# EAGLE design eurofima (EAGLE 9.5.2)
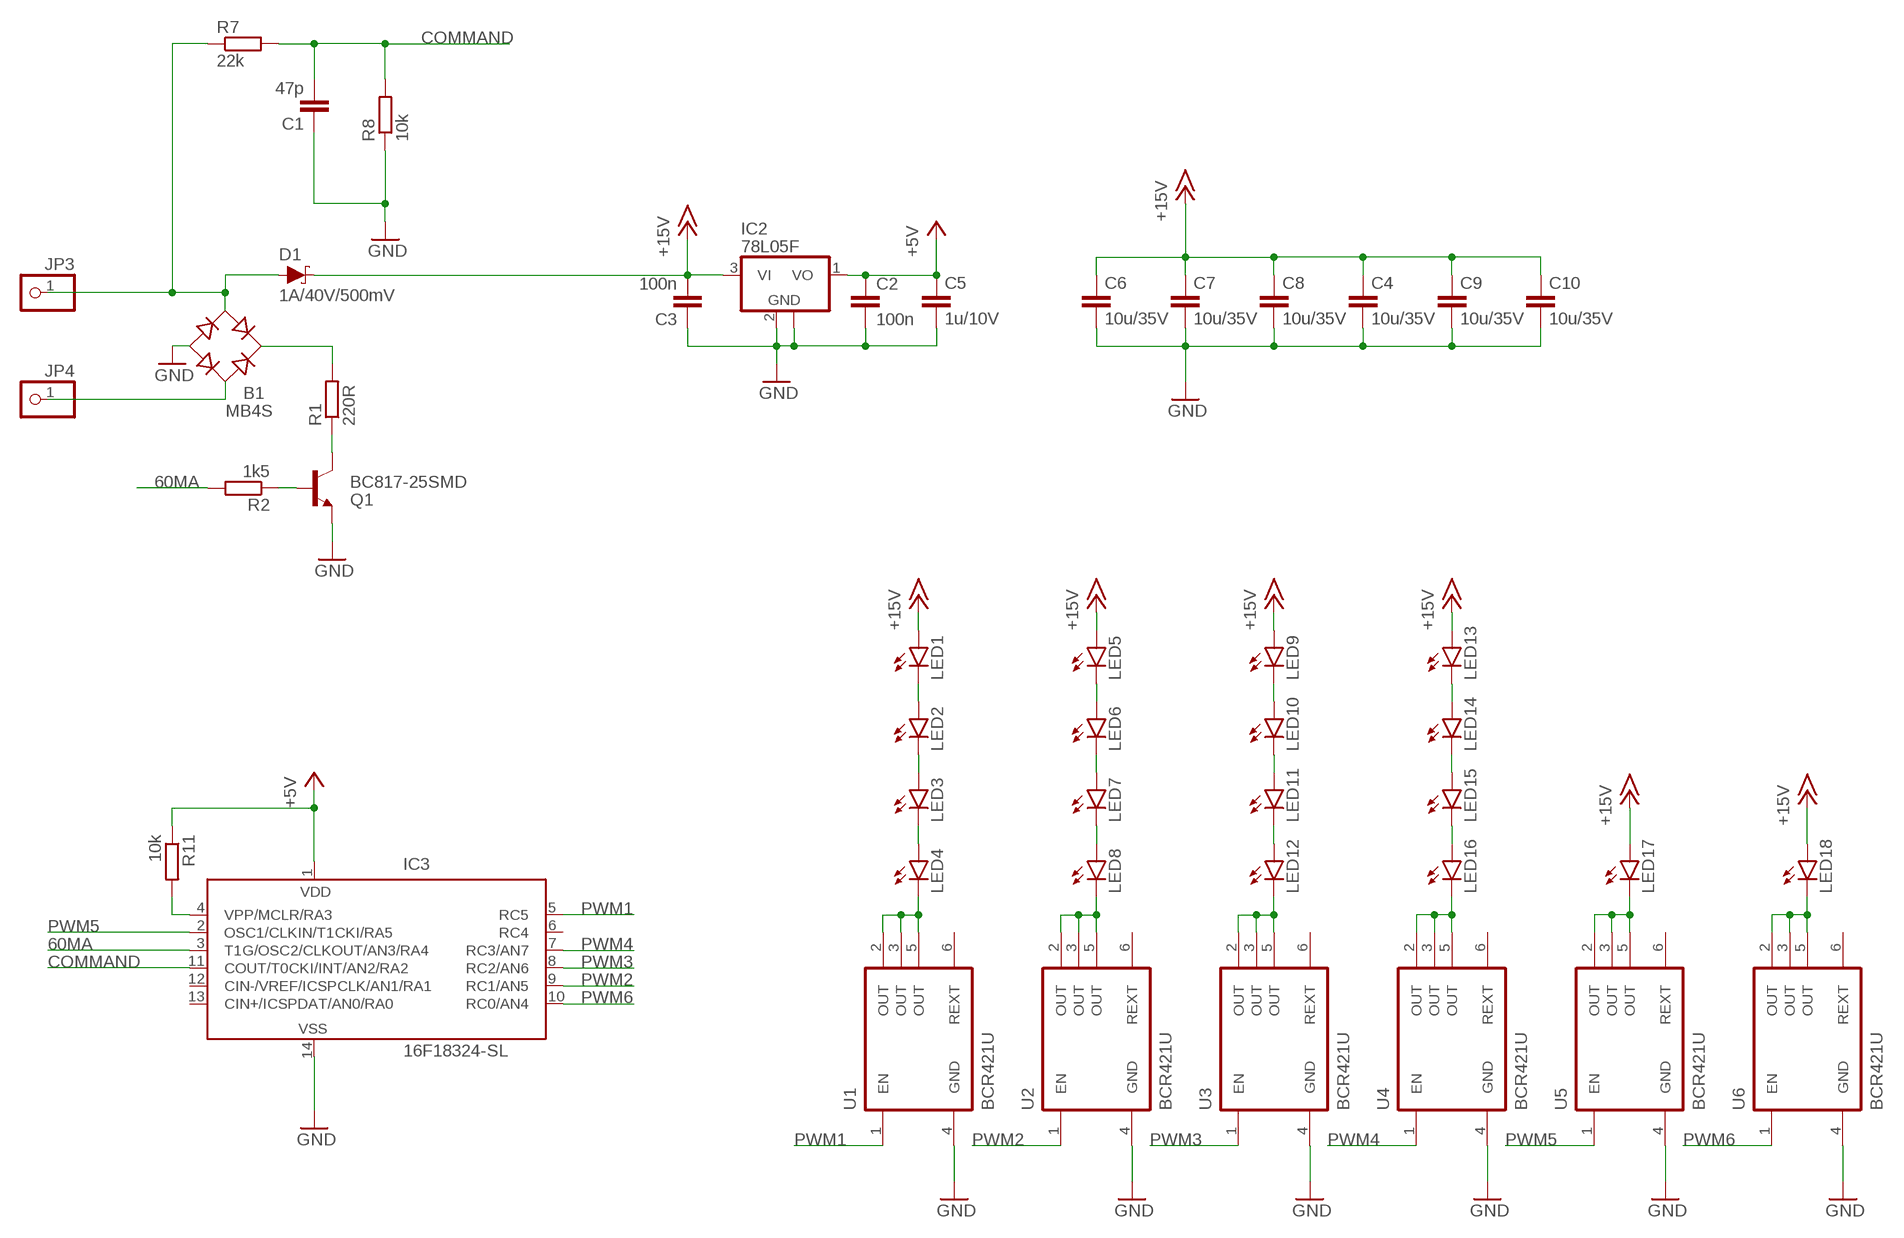
[diagram p0: schematic, sheet 1]

## Parts
B1  MB4S  [SOIC-4]
C1  47p  C-EUC0805  [C0805]
C2  100n  C-EUC3216  [C3216]
C3  100n  C-EUC3216  [C3216]
C4  10u/35V  C-EUC3216  [C3216]
C5  1u/10V  C-EUC3216  [C3216]
C6  10u/35V  C-EUC3216  [C3216]
C7  10u/35V  C-EUC3216  [C3216]
C8  10u/35V  C-EUC3216  [C3216]
C9  10u/35V  C-EUC3216  [C3216]
C10  10u/35V  C-EUC3216  [C3216]
D1  1A/40V/500mV  DIODE-SCHOTTKY-SS14  [SMA-DIODE]
IC2  78L05F  [SOT89]
IC3  16F18324-SL  PIC16F676SL  [SO-14]
JP3  PINHD-1X1  [1X01]
JP4  PINHD-1X1  [1X01]
LED1  LEDKA-3528ASYC  [KA-3528ASYC]
LED2  LEDKA-3528ASYC  [KA-3528ASYC]
LED3  LEDKA-3528ASYC  [KA-3528ASYC]
LED4  LEDKA-3528ASYC  [KA-3528ASYC]
LED5  LEDKA-3528ASYC  [KA-3528ASYC]
LED6  LEDKA-3528ASYC  [KA-3528ASYC]
LED7  LEDKA-3528ASYC  [KA-3528ASYC]
LED8  LEDKA-3528ASYC  [KA-3528ASYC]
LED9  LEDKA-3528ASYC  [KA-3528ASYC]
LED10  LEDKA-3528ASYC  [KA-3528ASYC]
LED11  LEDKA-3528ASYC  [KA-3528ASYC]
LED12  LEDKA-3528ASYC  [KA-3528ASYC]
LED13  LEDKA-3528ASYC  [KA-3528ASYC]
LED14  LEDKA-3528ASYC  [KA-3528ASYC]
LED15  LEDKA-3528ASYC  [KA-3528ASYC]
LED16  LEDKA-3528ASYC  [KA-3528ASYC]
LED17  LED3MM  [LED3MM]
LED18  LED3MM  [LED3MM]
Q1  BC817-25SMD  [SOT23-BEC]
R1  220R  R-EU_R1206  [R1206]
R2  1k5  R-EU_R1206  [R1206]
R7  22k  R-EU_R1206  [R1206]
R8  10k  R-EU_R1206  [R1206]
R11  10k  R-EU_R1206  [R1206]
U1  BCR421U  [SC74-6]
U2  BCR421U  [SC74-6]
U3  BCR421U  [SC74-6]
U4  BCR421U  [SC74-6]
U5  BCR421U  [SC74-6]
U6  BCR421U  [SC74-6]

## Nets
60MA: IC3.3(T1G/OSC2/CLKOUT/AN3/RA4) R2.2
+5V: C2.1 C5.1 IC2.1(VO) IC3.1(VDD) R11.1
+15V: C3.2 C4.1 C6.1 C7.1 C8.1 C9.1 C10.1 D1.C IC2.3(VI) LED1.A LED5.A LED9.A LED13.A LED17.A LED18.A
COMMAND: C1.2 IC3.11(COUT/T0CKI/INT/AN2/RA2) R7.2 R8.2
GND: B1.- C1.1 C2.2 C3.1 C4.2 C5.2 C6.2 C7.2 C8.2 C9.2 C10.2 IC2.2(GND) IC2.2@1(GND) IC3.14(VSS) Q1.E R8.1 U1.4(GND) U2.4(GND) U3.4(GND) U4.4(GND) U5.4(GND) U6.4(GND)
N$1: B1.~2(AC2) JP4.1
N$2: B1.~1(AC1) D1.A JP3.1 R7.1
N$3: Q1.C R1.1
N$4: Q1.B R2.1
N$5: B1.+ R1.2
N$10: LED3.C LED4.A
N$11: LED7.C LED8.A
N$12: LED11.C LED12.A
N$13: LED15.C LED16.A
N$14: LED16.C U4.2(OUT) U4.3(OUT) U4.5(OUT)
N$15: LED14.C LED15.A
N$16: LED10.C LED11.A
N$19: LED6.C LED7.A
N$20: LED2.C LED3.A
N$21: LED1.C LED2.A
N$22: LED5.C LED6.A
N$23: LED9.C LED10.A
N$24: LED13.C LED14.A
N$27: LED17.K(C) U5.2(OUT) U5.3(OUT) U5.5(OUT)
N$28: IC3.4(VPP/MCLR/RA3) R11.2
N$29: LED18.K(C) U6.2(OUT) U6.3(OUT) U6.5(OUT)
N$30: LED4.C U1.2(OUT) U1.3(OUT) U1.5(OUT)
N$31: LED12.C U3.2(OUT) U3.3(OUT) U3.5(OUT)
N$32: LED8.C U2.2(OUT) U2.3(OUT) U2.5(OUT)
PWM1: IC3.5(RC5) U1.1(EN)
PWM2: IC3.9(RC1/AN5) U2.1(EN)
PWM3: IC3.8(RC2/AN6) U3.1(EN)
PWM4: IC3.7(RC3/AN7) U4.1(EN)
PWM5: IC3.2(OSC1/CLKIN/T1CKI/RA5) U5.1(EN)
PWM6: IC3.10(RC0/AN4) U6.1(EN)
Unconnected: IC3.6(RC4) IC3.12(CIN-/VREF/ICSPCLK/AN1/RA1) IC3.13(CIN+/ICSPDAT/AN0/RA0) U1.6(REXT) U2.6(REXT) U3.6(REXT) U4.6(REXT) U5.6(REXT) U6.6(REXT)

## Library data of the parts
B1 = rectifier:MB*S: Bridge Rectifier Source: http://www.fairchildsemi.com/ds/MB/MB6S.pdf
C1-C10 = rcl:C-EU: CAPACITOR, European symbol; SPICEPREFIX: C
D1 = SparkFun-DiscreteSemi:DIODE-SCHOTTKY: Schottky diode A Schottky diode is a semiconductor diode which has a low forward voltage drop and a very fast switching action.; PROD_ID: DIO-08053
IC2 = linear:78L*: POSITOIV-VOLTAGE REGULATORS Output up to 100 mA Source: Datasheet <http://focus.ti.com/lit/ds/symlink/ua78l05.pdf>
IC3 = microchip:PIC16F676: 14-Pin, Flash-Based 8-Bit CMOS Microcontroller High Performance RISC CPU: * Only 35 instructions to learn - All single-cycle instructions except branches * Operating speed: - DC - 20 MHz oscillator/clock input - DC - 200 ns instruction cycle * Internal and external oscillator options - Precision Internal 4 MHz oscillator factory calibrated to ±1% - External Oscillator support for crystals and resonators - 5?s wake-up from SLEEP, 3.0V, typical * Power saving SLEEP mode * Wide operating voltage range - 2.0V to 5.5V * Industrial and Extended temperature range * Low power Power-on Reset (POR) * Power-up Timer (PWRT) and Oscillator Start-up Timer (OST) * Brown-out Detect (BOD) * Watchdog Timer (WDT) with independent oscillator for reliable operation * Multiplexed MCLR/Input-pin * Interrupt-on-pin change * Individual programmable weak pull-ups * Programmable code protection * High Endurance FLASH/EEPROM Cell - 100,000 write FLASH endurance - 1,000,000 write EEPROM endurance - FLASH/Data EEPROM Retention: > 40 years * Standby Current: - 1 nA @ 2.0V, typical * Operating Current: - 8.5?A @ 32 kHz, 2.0V, typical - 100?A @ 1 MHz, 2.0V, typical * Watchdog Timer Current - 300 nA @ 2.0V, typical * Timer1 oscillator current: - 4?A @ 32 kHz, 2.0V, typical * 12 I/O pins with individual direction control * High current sink/source for direct LED drive * Analog-to-Digital Converter module (PIC16F676): - 10-bit resolution - Programmable 8-channel input - Voltage reference input * In-Circuit Serial ProgrammingTM (ICSPTM) via two pins Source: http://ww1.microchip.com/downloads/en/DeviceDoc/40039E.pdf; MF: MICROCHIP; MPN: PIC16F676-I/SL; OC_FARNELL: 9760520; OC_NEWARK: 92C4557
JP3 JP4 = pinhead:PINHD-1X1: PIN HEADER
LED1-LED18 = led:LED: LED OSRAM: - CHIPLED LG R971, LG N971, LY N971, LG Q971, LY Q971, LO R971, LY R971 LH N974, LH R974 LS Q976, LO Q976, LY Q976 LO Q996 - Hyper CHIPLED LW Q18S LB Q993, LB Q99A, LB R99A - SideLED LS A670, LO A670, LY A670, LG A670, LP A670 LB A673, LV A673, LT A673, LW A673 LH A674 LY A675 LS A676, LA A676, LO A676, LY A676, LW A676 LS A679, LY A679, LG A679 - Hyper Micro SIDELED® LS Y876, LA Y876, LO Y876, LY Y876 LT Y87S - SmartLED LW L88C, LW L88S LB L89C, LB L89S, LG L890 LS L89K, LO L89K, LY L89K LS L896, LA L896, LO L896, LY L896 - TOPLED LS T670, LO T670, LY T670, LG T670, LP T670 LSG T670, LSP T670, LSY T670, LOP T670, LYG T670 LG T671, LOG T671, LSG T671 LB T673, LV T673, LT T673, LW T673 LH T674 LS T676, LA T676, LO T676, LY T676, LB T676, LH T676, LSB T676, LW T676 LB T67C, LV T67C, LT T67C, LS T67K, LO T67K, LY T67K, LW E67C LS E67B, LA E67B, LO E67B, LY E67B, LB E67C, LV E67C, LT E67C LW T67C LS T679, LY T679, LG T679 LS T770, LO T770, LY T770, LG T770, LP T770 LB T773, LV T773, LT T773, LW T773 LH T774 LS E675, LA E675, LY E675, LS T675 LS T776, LA T776, LO T776, LY T776, LB T776 LHGB T686 LT T68C, LB T68C - Hyper Mini TOPLED® LB M676 - Mini TOPLED Santana® LG M470 LS M47K, LO M47K, LY M47K Source: http://www.osram.convergy.de LUXEON: - LUMILED® LXK2-PW12-R00, LXK2-PW12-S00, LXK2-PW14-U00, LXK2-PW14-V00 LXK2-PM12-R00, LXK2-PM12-S00, LXK2-PM14-U00 LXK2-PE12-Q00, LXK2-PE12-R00, LXK2-PE12-S00, LXK2-PE14-T00, LXK2-PE14-U00 LXK2-PB12-K00, LXK2-PB12-L00, LXK2-PB12-M00, LXK2-PB14-N00, LXK2-PB14-P00, LXK2-PB14-Q00 LXK2-PR12-L00, LXK2-PR12-M00, LXK2-PR14-Q00, LXK2-PR14-R00 LXK2-PD12-Q00, LXK2-PD12-R00, LXK2-PD12-S00 LXK2-PH12-R00, LXK2-PH12-S00 LXK2-PL12-P00, LXK2-PL12-Q00, LXK2-PL12-R00 Source: www.luxeon.com KINGBRIGHT: KA-3528ASYC Source: www.kingbright.com
Q1 = transistor-npn:BC817*: NPN Transistor
R1 R2 R7 R8 R11 = rcl:R-EU_: RESISTOR, European symbol; SPICEPREFIX: R
U1-U6 = BCR421U:BCR421U: LED DRIVER; AVAILABILITY: Unavailable; DESCRIPTION: LED Driver IC 1 Output Linear PWM Dimming 350mA SOT-26; MF: Infineon; MP: BCR421U; PACKAGE: SC-74 Infineon; PRICE: None

## Board
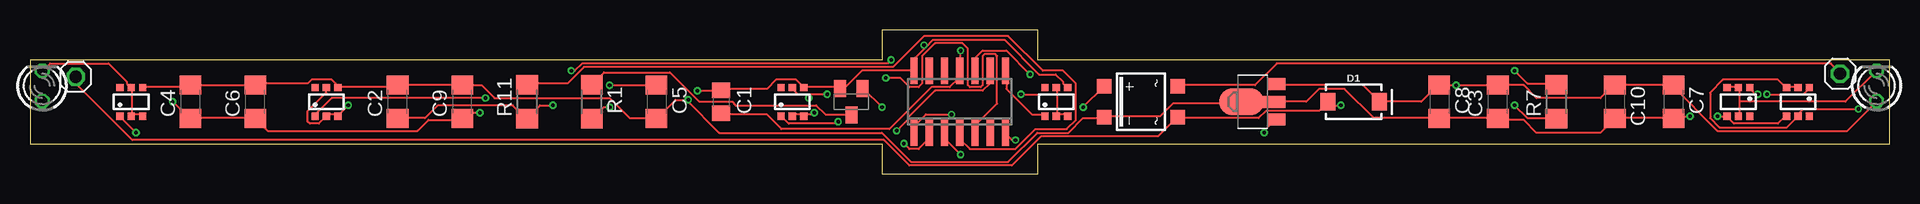
[diagram p1: board, top side]
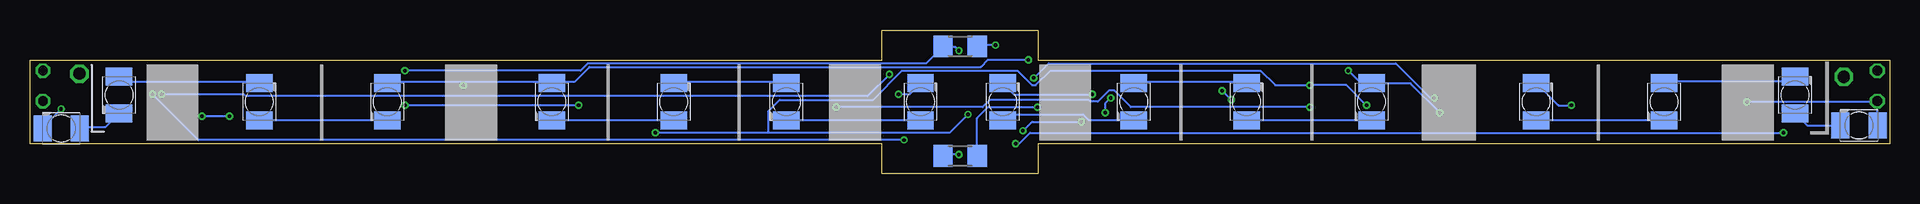
[diagram p2: board, bottom side, seen from below]

Size 155 x 12 mm. Coordinates in mm from the lower left corner, seen from the top.
Outline: 0,2.5 71,2.5 71,0 84,0 84,2.5 155,2.5 155,9.5 84,9.5 84,12 71,12 71,9.5 0,9.5 0,2.5
Copper layers (1*16): Top 0.035mm / dielectric 1.5mm / Bottom 0.035mm
Design rules "default *": minimum track width 6mil, minimum drill 0.3mm, track to track 6mil, track to pad 6mil, pad to pad 6mil, via to via 6mil, smd to smd 6mil, copper to edge 6mil, drill to drill 6mil, minimum pad ring 6mil, minimum via ring 6mil, stop-mask expansion 4mil, vias tented up to drill 0mil, thermal gap 10mil

### Footprints (pad centres in the part's own frame; a part is rotated, then mirrored left to right if it is on the bottom)
SOIC-4 = smd 1.2 x 1.2: + 1.3,3.05; - -1.3,3.05; ~1 -1.3,-3.05; ~2 1.3,-3.05
C0805 = smd 1.3 x 1.5: 1 -0.95,0; 2 0.95,0
C3216 = smd 1.6 x 1.8: 1 -1.4,0; 2 1.4,0
SMA-DIODE = smd 1.27 x 1.47: A -2.15,0; C 2.15,0
SOT89 = smd 1 x 1.5: 1 -1.499,-1.981; 3 1.499,-1.981 | smd 1 x 2: 2 0,-1.727 | smd 2.2 x 3.7: 2@1 0,0.94
SO-14 = smd 0.6 x 2.2: 1 -3.81,-2.6; 2 -2.54,-2.6; 3 -1.27,-2.6; 4 0,-2.6; 5 1.27,-2.6; 6 2.54,-2.6; 7 3.81,-2.6; 8 3.81,2.6; 9 2.54,2.6; 10 1.27,2.6; 11 0,2.6; 12 -1.27,2.6; 13 -2.54,2.6; 14 -3.81,2.6
1X01 = drill 1.016 octagon: 1 0,0
KA-3528ASYC = smd 1.5 x 2.2: A -1.55,0; C 1.55,0
LED3MM = drill 0.813 octagon: A -1.27,0; K 1.27,0
SOT23-BEC = smd 1 x 1.4: B -0.95,-1.1; C 0,1.1; E 0.95,-1.1
R1206 = smd 1.6 x 1.803: 1 -1.422,0; 2 1.422,0
SC74-6 = smd 0.6 x 0.6: 1 -0.95,-1.2; 2 0,-1.2; 3 0.95,-1.2; 4 0.95,1.2; 5 0,1.2; 6 -0.95,1.2

### Placement (x,y rotation side)
B1  92.6,6 90 top
C1  57.61,6 270 top
C2  30.65,6 90 top
C3  122.35,6 90 top
C4  13.38,6 90 top
C5  52.22,6 270 top
C6  18.78,6 90 top
C7  136.98,6 270 top
C8  117.47,6 270 top
C9  36.04,6 90 top
C10  132.11,6 270 top
D1  110.33,6 0 top
IC2  101.91,6 90 top
IC3  77.5,6 0 top
JP3  3.81,8.09 0 top
JP4  150.88,8.34 0 top
LED1  2.54,4.02 180 bottom
LED2  7.87,6.56 90 bottom
LED3  18.8,6 270 bottom
LED4  29.46,6 90 bottom
LED5  43.18,6 270 bottom
LED6  53.59,6 90 bottom
LED7  62.99,6 270 bottom
LED8  73.91,6 90 bottom
LED9  111.51,6 270 bottom
LED10  101.35,6 90 bottom
LED11  91.95,6 270 bottom
LED12  80.77,6 90 bottom
LED13  125.22,6 270 bottom
LED14  135.89,6 90 bottom
LED15  147.57,6.56 270 bottom
LED16  152.4,3.77 180 bottom
LED17  1.02,7.33 90 top
LED18  153.92,7.33 90 top
Q1  68.46,6 180 top
R1  46.83,6 270 top
R2  77.47,1.48 180 bottom
R7  127.23,6 90 top
R8  77.47,10.63 180 bottom
R11  41.43,6 90 top
U1  24.71,6 0 top
U2  63.55,6 0 top
U3  85.54,6 0 top
U4  147.37,6 180 top
U5  8.45,6 0 top
U6  142.41,6 180 top

### Tracks (layer width: path | path; a pad name or v marks a point on that pad's centre or on a via)
60MA  (via drill 0.3)
  Top 0.152: v77.57,1.59 76.35,2.81 76.35,3.26 IC3.3
  Bottom 0.152: v77.57,1.59 78.79,1.59 R2.2
+5V  (via drill 0.3)
  Top 0.152: C2.1 30.79,4.63 32.92,4.63 33.98,5.7 40.23,5.7 41.3,4.63 R11.1 41.45,4.63 42.52,5.7 v43.59,5.7 | v48.31,7.38 52.12,7.38 C5.1 | v102.87,3.41 102.87,3.57 103.78,4.48 IC2.1 | v76.81,4.94 74.68,4.94 73.76,4.02 73.76,3.41 IC3.1
  Bottom 0.152: v43.59,5.7 45.26,7.38 v48.31,7.38 51.21,7.38 52.43,8.6 69.95,8.6 71.17,7.38 71.48,7.38 72.69,8.6 82.3,8.6 84.73,6.16 92.51,6.16 93.42,5.24 93.42,3.41 | 93.42,3.41 78.33,3.41 v76.81,4.94 | 93.42,3.41 v102.87,3.41
+15V  (via drill 0.3)
  Top 0.152: v37.49,5.09 36.58,5.09 36.12,4.63 C9.1 35.97,4.48 33.22,4.48 32.31,3.57 19.81,3.57 18.9,4.48 C6.1 18.75,4.63 13.41,4.63 C4.1 13.26,4.63 v11.89,6 | IC2.3 103.94,7.38 111.1,7.38 D1.C 112.62,6 115.98,6 117.35,7.38 C8.1 117.5,7.38 v118.87,7.38 122.22,7.38 C3.2 122.38,7.38 124.51,7.38 125.58,6.31 130.91,6.31 131.98,7.38 C10.1 132.13,7.38 136.85,7.38 | 136.85,7.38 140.66,3.57 151.49,3.57 153.92,6 LED18.A | 136.85,7.38 C7.1 | v45.11,8.6 45.41,8.6 46.02,9.21 71.48,9.21 v71.78,9.51
  Bottom 0.152: 1.07,6 1.07,4.02 LED1.A | v37.49,5.09 39.93,7.53 43.13,7.53 LED5.A 43.28,7.68 44.2,7.68 v45.11,8.6 | v11.89,6 1.07,6 | 1.07,6 LED17.A | 118.87,7.68 125.12,7.68 LED13.A | 118.87,7.68 111.56,7.68 LED9.A 111.4,7.68 109.58,7.68 108.36,8.9 75.74,8.9 75.13,9.51 v71.78,9.51 | v118.87,7.38 118.87,7.68
COMMAND  (via drill 0.3)
  Top 0.152: C1.2 57.76,4.94 61.42,4.94 62.64,3.72 71.63,3.72 75.13,7.22 76.66,7.22 77.42,7.99 77.42,8.6 IC3.11 77.57,8.75 v77.57,10.27 | v123.75,8.6 124.82,7.53 127.1,7.53 R7.2
  Bottom 0.152: v77.57,10.27 77.88,10.58 78.79,10.58 R8.2 78.94,10.58 80.31,9.21 108.51,9.21 109.12,8.6 v123.75,8.6
GND  (via drill 0.3)
  Top 0.152: U4.4 146.3,4.79 145.69,4.18 142.04,4.18 141.58,4.63 141.58,4.79 U6.4 141.43,4.79 v140.66,4.79 | v138.38,4.79 137.16,4.79 137.01,4.63 C7.2 136.85,4.63 132.13,4.63 C10.2 131.98,4.48 130.91,3.41 125.58,3.41 124.51,4.48 122.38,4.48 C3.1 122.22,4.63 117.5,4.63 C8.2 117.35,4.63 112.01,4.63 109.58,7.07 107.44,7.07 106.38,6 103.78,6 IC2.2 101.04,6 IC2.2@1 100.89,5.85 95.25,5.85 94.18,4.79 89.61,4.79 B1.- 89.46,4.63 87.78,4.63 86.56,3.41 83.97,3.41 81.53,0.98 73.46,0.98 71.02,3.41 57.45,3.41 54.71,6.16 | 74.68,10.58 73.76,9.66 73.76,8.75 IC3.14 73.61,8.6 69.34,8.6 67.97,7.22 67.51,7.22 Q1.E 67.36,7.22 64.62,7.22 U2.4 64.47,7.22 63.86,7.83 62.18,7.83 61.42,7.07 57.76,7.07 C1.1 57.61,6.92 v55.63,6.92 | 74.68,10.58 75.29,11.19 81.23,11.19 84.12,8.29 85.5,8.29 86.11,7.68 86.11,7.53 86.41,7.22 U3.4 | 74.68,10.58 v74.52,10.73 | U5.4 9.45,7.22 13.11,7.22 13.26,7.38 C4.2 13.41,7.38 18.75,7.38 C6.2 18.9,7.53 23.16,7.53 23.47,7.83 25.15,7.83 25.76,7.22 | 25.76,7.22 30.48,7.22 30.63,7.38 C2.2 30.79,7.38 35.97,7.38 C9.2 36.12,7.38 37.64,7.38 38.71,6.31 48.31,6.31 49.99,4.63 52.12,4.63 C5.2 52.27,4.63 53.8,6.16 54.71,6.16 | 25.76,7.22 U1.4 | 54.71,6.16 v54.86,6.16
  Bottom 0.152: v138.38,4.79 v140.66,4.79 | v74.52,10.73 76.05,10.73 R8.1 | v54.86,6.16 v55.63,6.92
N$1
  Top 0.152: B1.~2 95.71,7.38 102.11,7.38 103.94,9.21 150.11,9.21 150.88,8.44 JP4.1
N$2  (via drill 0.3)
  Top 0.152: v123.75,5.7 124.82,4.63 127.1,4.63 R7.1 | v109.27,5.7 108.36,5.7 108.2,5.85 D1.A 108.05,5.85 107.44,5.24 103.02,5.24 102.41,4.63 95.71,4.63 B1.~1 95.56,4.63 94.03,3.11 84.28,3.11 81.84,0.67 73.3,0.67 71.17,2.81 8.53,2.81 3.81,7.53 JP3.1
  Bottom 0.152: v109.27,5.7 v123.75,5.7
N$3
  Top 0.152: Q1.C 68.43,4.94 66.29,4.94 65.53,5.7 58.83,5.7 58.52,6 55.78,6 53.34,8.44 47.85,8.44 46.94,7.53 R1.1
N$4  (via drill 0.3)
  Top 0.152: v71.02,5.55 69.49,7.07 Q1.B
  Bottom 0.152: v71.02,5.55 75.13,5.55 76.05,4.63 76.05,1.59 R2.1
N$5  (via drill 0.3)
  Top 0.152: v87.78,5.55 89.46,7.22 B1.+ | v48.31,5.55 47.85,5.55 46.94,4.63 R1.2
  Bottom 0.152: v87.78,5.55 75.59,5.55 74.98,6.16 66.75,6.16 66.6,6 65.99,6 65.08,6.92 64.62,6.92 63.25,5.55 v48.31,5.55
N$10
  Bottom 0.152: LED3.C 18.9,4.48 29.41,4.48 LED4.A
N$11
  Bottom 0.152: LED7.C 63.09,4.48 66.75,4.48 67.21,4.94 73.46,4.94 73.91,4.48 LED8.A
N$12
  Bottom 0.152: LED12.A 80.77,4.48 91.9,4.48 LED11.C
N$13
  Bottom 0.152: LED16.A 150.72,3.87 148.74,3.87 147.68,4.94 LED15.C
N$14  (via drill 0.3)
  Top 0.152: U4.2 147.22,7.22 146.46,7.22 U4.3 146.3,7.22 145.69,7.83 141.12,7.83 140.06,6.77 140.06,4.63 140.82,3.87 146.46,3.87 147.22,4.63 147.22,4.79 U4.5 147.37,4.94 147.83,5.4 v152.4,5.4
  Bottom 0.152: v152.4,5.4 153.92,3.87 LED16.C
N$15
  Bottom 0.152: LED14.C 135.94,7.68 147.22,7.68 147.52,7.99 LED15.A
N$16
  Bottom 0.152: LED11.A 92.05,7.68 101.35,7.68 LED10.C
N$19
  Bottom 0.152: LED6.C 53.65,7.68 62.94,7.68 LED7.A
N$20
  Bottom 0.152: LED3.A 18.75,7.68 8.23,7.68 7.92,7.99 LED2.C
N$21
  Bottom 0.152: LED1.C 6.86,4.02 7.77,4.94 LED2.A
N$22
  Bottom 0.152: LED5.C 43.28,4.48 53.49,4.48 LED6.A
N$23
  Bottom 0.152: LED10.A 101.35,4.48 111.4,4.48 LED9.C
N$24
  Bottom 0.152: LED13.C 125.27,4.48 135.79,4.48 LED14.A
N$27
  Top 0.152: 8.53,4.94 9.3,4.94 U5.3 | 8.53,4.94 8.53,7.07 U5.5 8.38,7.22 8.08,7.53 8.08,7.68 6.55,9.21 1.68,9.21 1.07,8.6 LED17.K | 8.53,4.94 U5.2
N$28
  Top 0.152: R11.2 41.45,7.53 44.81,7.53 46.18,8.9 71.93,8.9 74.52,11.49 81.53,11.49 84.43,8.6 86.11,8.6 87.17,7.53 87.17,4.48 86.41,3.72 83.82,3.72 82.14,2.04 78.33,2.04 77.57,2.81 77.57,3.26 IC3.4
N$29
  Top 0.152: U6.3 141.58,7.22 142.34,7.22 U6.2 142.49,7.07 142.49,6 | 142.49,6 142.49,4.94 U6.5 | 142.49,6 151.33,6 LED18.K
N$30  (via drill 0.3)
  Top 0.152: U1.5 24.69,7.07 24.69,6.77 23.16,5.24 23.16,4.33 23.32,4.18 24.08,4.18 24.69,4.79 U1.2 24.84,4.94 25.6,4.94 U1.3 25.76,4.94 v26.52,5.7
  Bottom 0.152: v26.52,5.7 27.58,5.7 29.41,7.53 LED4.C
N$31  (via drill 0.3)
  Top 0.152: 85.65,4.94 86.41,4.94 U3.3 | 85.65,4.94 85.65,6.62 | 85.65,6.62 85.65,7.07 U3.5 | 85.65,4.94 U3.2 | v82.6,6.62 85.65,6.62
  Bottom 0.152: v82.6,6.62 81.69,6.62 80.77,7.53 LED12.C
N$32  (via drill 0.3)
  Top 0.152: U2.2 63.55,4.94 64.47,4.94 U2.3 64.62,4.94 65.23,4.94 v65.38,5.09 | v66.45,6.62 64.92,6.62 | 64.92,6.62 64.01,6.62 63.55,7.07 U2.5 | 64.92,6.62 v64.92,6.31
  Bottom 0.152: v66.45,6.62 73,6.62 73.91,7.53 LED8.C | v65.38,5.09 65.38,5.85 v64.92,6.31
PWM1  (via drill 0.3)
  Top 0.152: v37.95,6.31 25.15,6.31 23.77,4.94 U1.1 | v71.32,7.99 72.54,7.99 73.3,7.22 74.07,7.22 74.37,7.53 74.37,9.82 75.44,10.88 77.72,10.88 78.18,10.43 78.18,7.38 78.33,7.22 79.25,7.22 79.4,7.38 79.4,9.82 79.55,9.97 80.47,9.97 80.62,9.82 80.62,5.85 78.79,4.02 78.79,3.41 IC3.5
  Bottom 0.152: v37.95,6.31 38.25,6.31 41.15,9.21 70.1,9.21 v71.32,7.99
PWM2  (via drill 0.3)
  Top 0.152: v67.36,4.33 67.21,4.18 63.25,4.18 62.64,4.79 U2.1 | v72.24,3.57 73.15,4.48 73.15,4.63 75.44,6.92 79.4,6.92 80.01,7.53 80.01,8.6 IC3.9
  Bottom 0.152: v67.36,4.33 71.48,4.33 v72.24,3.57
PWM3
  Top 0.152: U3.1 84.58,4.94 83.52,4.94 81.38,7.07 81.38,8.6 IC3.8
PWM4  (via drill 0.3)
  Top 0.152: v144.78,6.62 147.83,6.62 148.28,7.07 U4.1 | v82.14,2.81 81.84,2.81 81.38,3.26 IC3.7
  Bottom 0.152: v144.78,6.62 140.97,2.81 v82.14,2.81
PWM5  (via drill 0.3)
  Top 0.152: v8.84,3.41 7.62,4.63 7.62,4.79 U5.1 | v72.85,2.5 73.3,2.04 74.07,2.04 74.83,2.81 74.83,3.26 IC3.2
  Bottom 0.152: v8.84,3.41 71.63,3.41 72.54,2.5 v72.85,2.5
PWM6  (via drill 0.3)
  Top 0.152: v144.02,6.62 143.87,6.62 143.41,7.07 U6.1 | v83.36,8.29 81.38,10.27 79.4,10.27 78.79,9.66 78.79,8.75 IC3.10
  Bottom 0.152: v144.02,6.62 137.16,6.62 137.01,6.46 85.19,6.46 v83.36,8.29

### Text on the board
tValues: https://github.com/stb49078/nscale-adapter-decoder